# EAGLE design in_out (EAGLE 7.7.0)
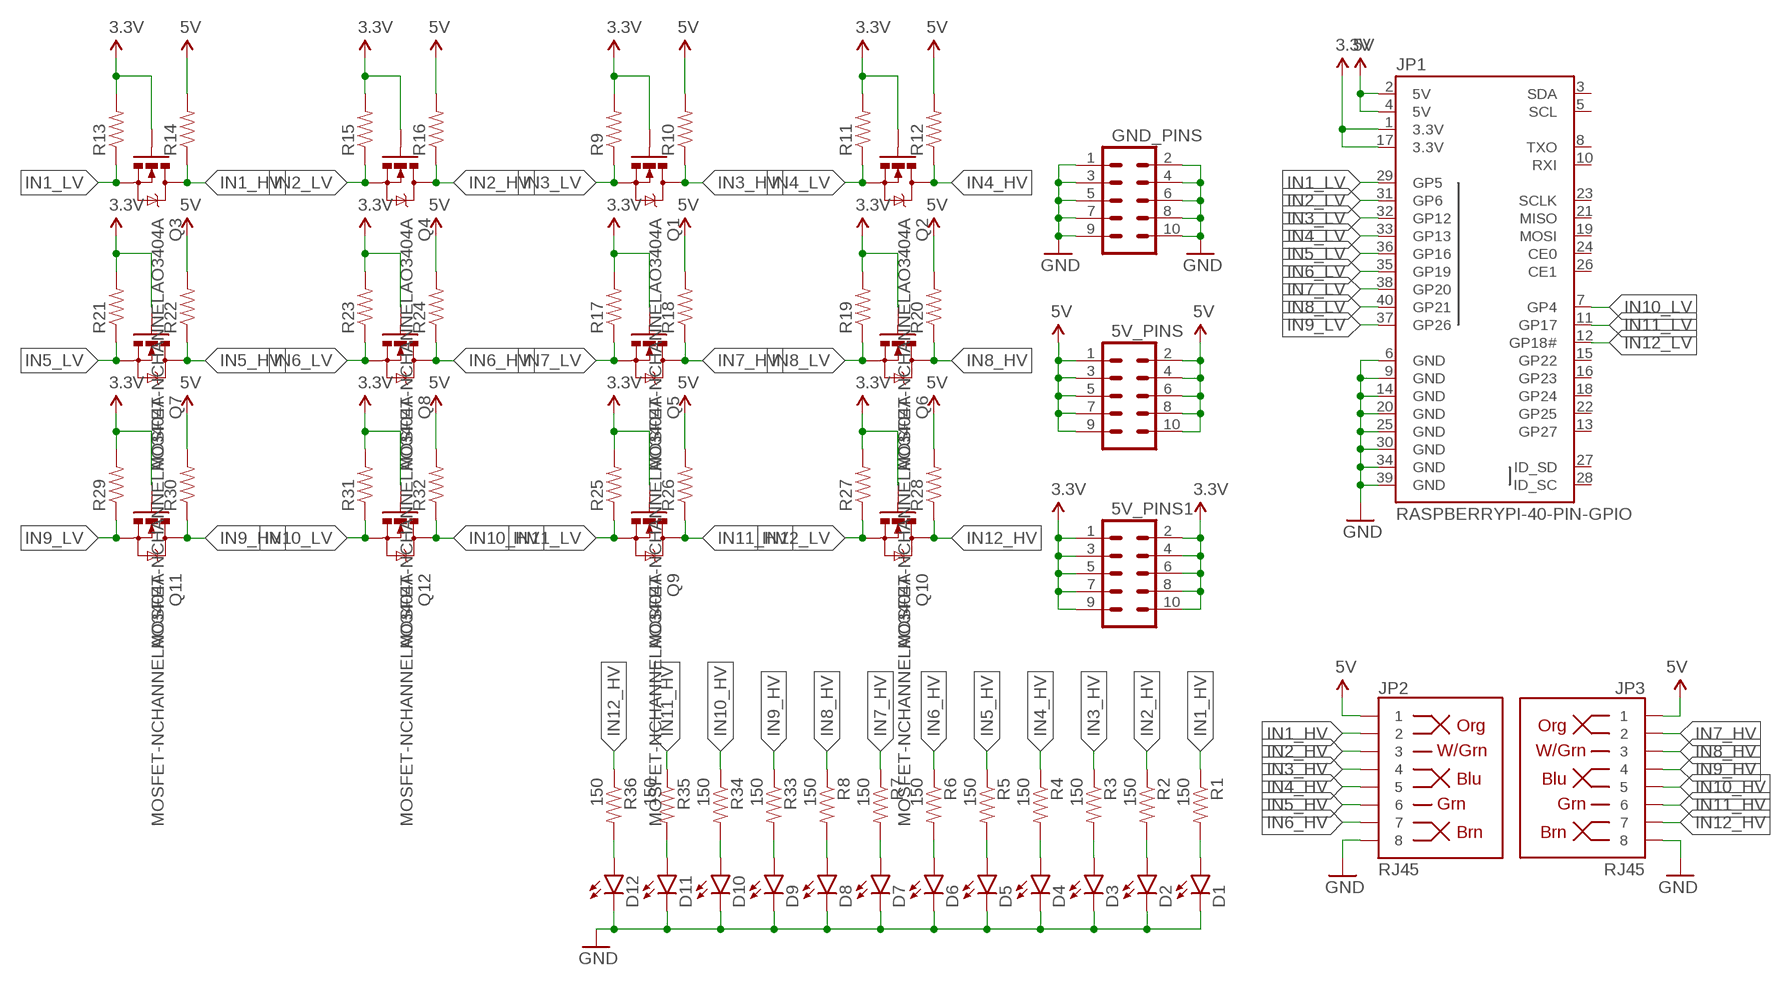
[diagram p0: schematic, sheet 1]

## Parts
5V_PINS  M05X2PTH  [AVR_ICSP]
5V_PINS1  M05X2PTH  [AVR_ICSP]
D1  LED5MM  [LED5MM]
D2  LED5MM  [LED5MM]
D3  LED5MM  [LED5MM]
D4  LED5MM  [LED5MM]
D5  LED5MM  [LED5MM]
D6  LED5MM  [LED5MM]
D7  LED5MM  [LED5MM]
D8  LED5MM  [LED5MM]
D9  LED5MM  [LED5MM]
D10  LED5MM  [LED5MM]
D11  LED5MM  [LED5MM]
D12  LED5MM  [LED5MM]
GND_PINS  M05X2PTH  [AVR_ICSP]
JP1  RASPBERRYPI-40-PIN-GPIO  [2X20-SHROUDED]
JP2  RJ45  RJ45-8PTH  [RJ45-8]
JP3  RJ45  RJ45-8PTH  [RJ45-8]
Q1  MOSFET-NCHANNELAO3404A  [SOT23-3]
Q2  MOSFET-NCHANNELAO3404A  [SOT23-3]
Q3  MOSFET-NCHANNELAO3404A  [SOT23-3]
Q4  MOSFET-NCHANNELAO3404A  [SOT23-3]
Q5  MOSFET-NCHANNELAO3404A  [SOT23-3]
Q6  MOSFET-NCHANNELAO3404A  [SOT23-3]
Q7  MOSFET-NCHANNELAO3404A  [SOT23-3]
Q8  MOSFET-NCHANNELAO3404A  [SOT23-3]
Q9  MOSFET-NCHANNELAO3404A  [SOT23-3]
Q10  MOSFET-NCHANNELAO3404A  [SOT23-3]
Q11  MOSFET-NCHANNELAO3404A  [SOT23-3]
Q12  MOSFET-NCHANNELAO3404A  [SOT23-3]
R1  150  RESISTOREZ  [AXIAL-0.3EZ]
R2  150  RESISTOREZ  [AXIAL-0.3EZ]
R3  150  RESISTOREZ  [AXIAL-0.3EZ]
R4  150  RESISTOREZ  [AXIAL-0.3EZ]
R5  150  RESISTOREZ  [AXIAL-0.3EZ]
R6  150  RESISTOREZ  [AXIAL-0.3EZ]
R7  150  RESISTOREZ  [AXIAL-0.3EZ]
R8  150  RESISTOREZ  [AXIAL-0.3EZ]
R9  RESISTORPTH-1/4W  [AXIAL-0.4]
R10  RESISTORPTH-1/4W  [AXIAL-0.4]
R11  RESISTORPTH-1/4W  [AXIAL-0.4]
R12  RESISTORPTH-1/4W  [AXIAL-0.4]
R13  RESISTORPTH-1/4W  [AXIAL-0.4]
R14  RESISTORPTH-1/4W  [AXIAL-0.4]
R15  RESISTORPTH-1/4W  [AXIAL-0.4]
R16  RESISTORPTH-1/4W  [AXIAL-0.4]
R17  RESISTORPTH-1/4W  [AXIAL-0.4]
R18  RESISTORPTH-1/4W  [AXIAL-0.4]
R19  RESISTORPTH-1/4W  [AXIAL-0.4]
R20  RESISTORPTH-1/4W  [AXIAL-0.4]
R21  RESISTORPTH-1/4W  [AXIAL-0.4]
R22  RESISTORPTH-1/4W  [AXIAL-0.4]
R23  RESISTORPTH-1/4W  [AXIAL-0.4]
R24  RESISTORPTH-1/4W  [AXIAL-0.4]
R25  RESISTORPTH-1/4W  [AXIAL-0.4]
R26  RESISTORPTH-1/4W  [AXIAL-0.4]
R27  RESISTORPTH-1/4W  [AXIAL-0.4]
R28  RESISTORPTH-1/4W  [AXIAL-0.4]
R29  RESISTORPTH-1/4W  [AXIAL-0.4]
R30  RESISTORPTH-1/4W  [AXIAL-0.4]
R31  RESISTORPTH-1/4W  [AXIAL-0.4]
R32  RESISTORPTH-1/4W  [AXIAL-0.4]
R33  150  RESISTOREZ  [AXIAL-0.3EZ]
R34  150  RESISTOREZ  [AXIAL-0.3EZ]
R35  150  RESISTOREZ  [AXIAL-0.3EZ]
R36  150  RESISTOREZ  [AXIAL-0.3EZ]

## Nets
3.3V: 5V_PINS1.1 5V_PINS1.2 5V_PINS1.3 5V_PINS1.4 5V_PINS1.5 5V_PINS1.6 5V_PINS1.7 5V_PINS1.8 5V_PINS1.9 5V_PINS1.10 JP1.1(3.3V) JP1.17(3.3V) Q1.1(G) Q2.1(G) Q3.1(G) Q4.1(G) Q5.1(G) Q6.1(G) Q7.1(G) Q8.1(G) Q9.1(G) Q10.1(G) Q11.1(G) Q12.1(G) R9.P$2 R11.P$2 R13.P$2 R15.P$2 R17.P$2 R19.P$2 R21.P$2 R23.P$2 R25.P$2 R27.P$2 R29.P$2 R31.P$2
5V: 5V_PINS.1 5V_PINS.2 5V_PINS.3 5V_PINS.4 5V_PINS.5 5V_PINS.6 5V_PINS.7 5V_PINS.8 5V_PINS.9 5V_PINS.10 JP1.2(5V) JP1.4(5V) JP2.1 JP3.1 R10.P$2 R12.P$2 R14.P$2 R16.P$2 R18.P$2 R20.P$2 R22.P$2 R24.P$2 R26.P$2 R28.P$2 R30.P$2 R32.P$2
GND: D1.K(C) D2.K(C) D3.K(C) D4.K(C) D5.K(C) D6.K(C) D7.K(C) D8.K(C) D9.K(C) D10.K(C) D11.K(C) D12.K(C) GND_PINS.1 GND_PINS.2 GND_PINS.3 GND_PINS.4 GND_PINS.5 GND_PINS.6 GND_PINS.7 GND_PINS.8 GND_PINS.9 GND_PINS.10 JP1.6(GND) JP1.9(GND) JP1.14(GND) JP1.20(GND) JP1.25(GND) JP1.30(GND) JP1.34(GND) JP1.39(GND) JP2.8 JP3.8
IN1_HV: JP2.2 Q3.3(D) R1.P$1 R14.P$1
IN1_LV: JP1.29(GP5) Q3.2(S) R13.P$1
IN2_HV: JP2.3 Q4.3(D) R2.P$1 R16.P$1
IN2_LV: JP1.31(GP6) Q4.2(S) R15.P$1
IN3_HV: JP2.4 Q1.3(D) R3.P$1 R10.P$1
IN3_LV: JP1.32(GP12) Q1.2(S) R9.P$1
IN4_HV: JP2.5 Q2.3(D) R4.P$1 R12.P$1
IN4_LV: JP1.33(GP13) Q2.2(S) R11.P$1
IN5_HV: JP2.6 Q7.3(D) R5.P$1 R22.P$1
IN5_LV: JP1.36(GP16) Q7.2(S) R21.P$1
IN6_HV: JP2.7 Q8.3(D) R6.P$1 R24.P$1
IN6_LV: JP1.35(GP19) Q8.2(S) R23.P$1
IN7_HV: JP3.2 Q5.3(D) R7.P$1 R18.P$1
IN7_LV: JP1.38(GP20) Q5.2(S) R17.P$1
IN8_HV: JP3.3 Q6.3(D) R8.P$1 R20.P$1
IN8_LV: JP1.40(GP21) Q6.2(S) R19.P$1
IN9_HV: JP3.4 Q11.3(D) R30.P$1 R33.P$1
IN9_LV: JP1.37(GP26) Q11.2(S) R29.P$1
IN10_HV: JP3.5 Q12.3(D) R32.P$1 R34.P$1
IN10_LV: JP1.7(GP4) Q12.2(S) R31.P$1
IN11_HV: JP3.6 Q9.3(D) R26.P$1 R35.P$1
IN11_LV: JP1.11(GP17) Q9.2(S) R25.P$1
IN12_HV: JP3.7 Q10.3(D) R28.P$1 R36.P$1
IN12_LV: JP1.12(GP18#) Q10.2(S) R27.P$1
N$1: D9.A R33.P$2
N$2: D10.A R34.P$2
N$3: D1.A R1.P$2
N$4: D2.A R2.P$2
N$5: D3.A R3.P$2
N$6: D4.A R4.P$2
N$7: D5.A R5.P$2
N$8: D6.A R6.P$2
N$9: D7.A R7.P$2
N$10: D8.A R8.P$2
N$11: D11.A R35.P$2
N$12: D12.A R36.P$2
Unconnected: JP1.3(SDA) JP1.5(SCL) JP1.8(TXO) JP1.10(RXI) JP1.13(GP27) JP1.15(GP22) JP1.16(GP23) JP1.18(GP24) JP1.19(MOSI) JP1.21(MISO) JP1.22(GP25) JP1.23(SCLK) JP1.24(CE0) JP1.26(CE1) JP1.27(ID_SD) JP1.28(ID_SC)

## Library data of the parts
5V_PINS 5V_PINS1 GND_PINS = SparkFun-Connectors:M05X2: Header 5x2 Standard 10-pin dual row 0.1" header. Commonly used with AVR-ISP. Use with Spark Fun Electronics SKU: PRT-00778
D1-D12 = SparkFun-LED:LED: LEDs Standard schematic elements and footprints for 5mm, 3mm, 1206, and 0603 sized LEDs. 5mm - Spark Fun Electronics SKU : COM-00529 (and others)
JP1 = SparkFun-Boards:RASPBERRYPI-40-PIN-GPIO: Second Generation Raspberry Pi GPIO Header 2x20 pin connector, as found on B, B+, A+ models.
JP2 JP3 = SparkFun-Connectors:RJ45-8: RJ45 Jack Simple RJ45, 8-pin connection - connector for common Cat5, Cat5e, and Cat6 Ethernet cables. Footprint not yet proven in production. Connector sku is PRT-00643; Breakout PCB sku is BOB-00716.; PROD_ID: CONN-08506
Q1-Q12 = SparkFun-DiscreteSemi:MOSFET-NCHANNEL: Common NMOSFET Parts MFG P/N Store ID Prod ID FDD8780 TRANS-09984 SI7820DN TRANS-11055 FDS6630A IC-08089 2N7002PW TRANS-11151 FQP30N06L COM-10213 TRANS-10060 BSS123LT1G TRANS-08345 BSS138 TRANS-00830 BS170 2N7000; PROD_ID: TRAN-12988
R1-R36 = SparkFun-Passives:RESISTOR: Resistor Basic schematic elements and footprints for 0603, 1206, and PTH resistors.

## Board
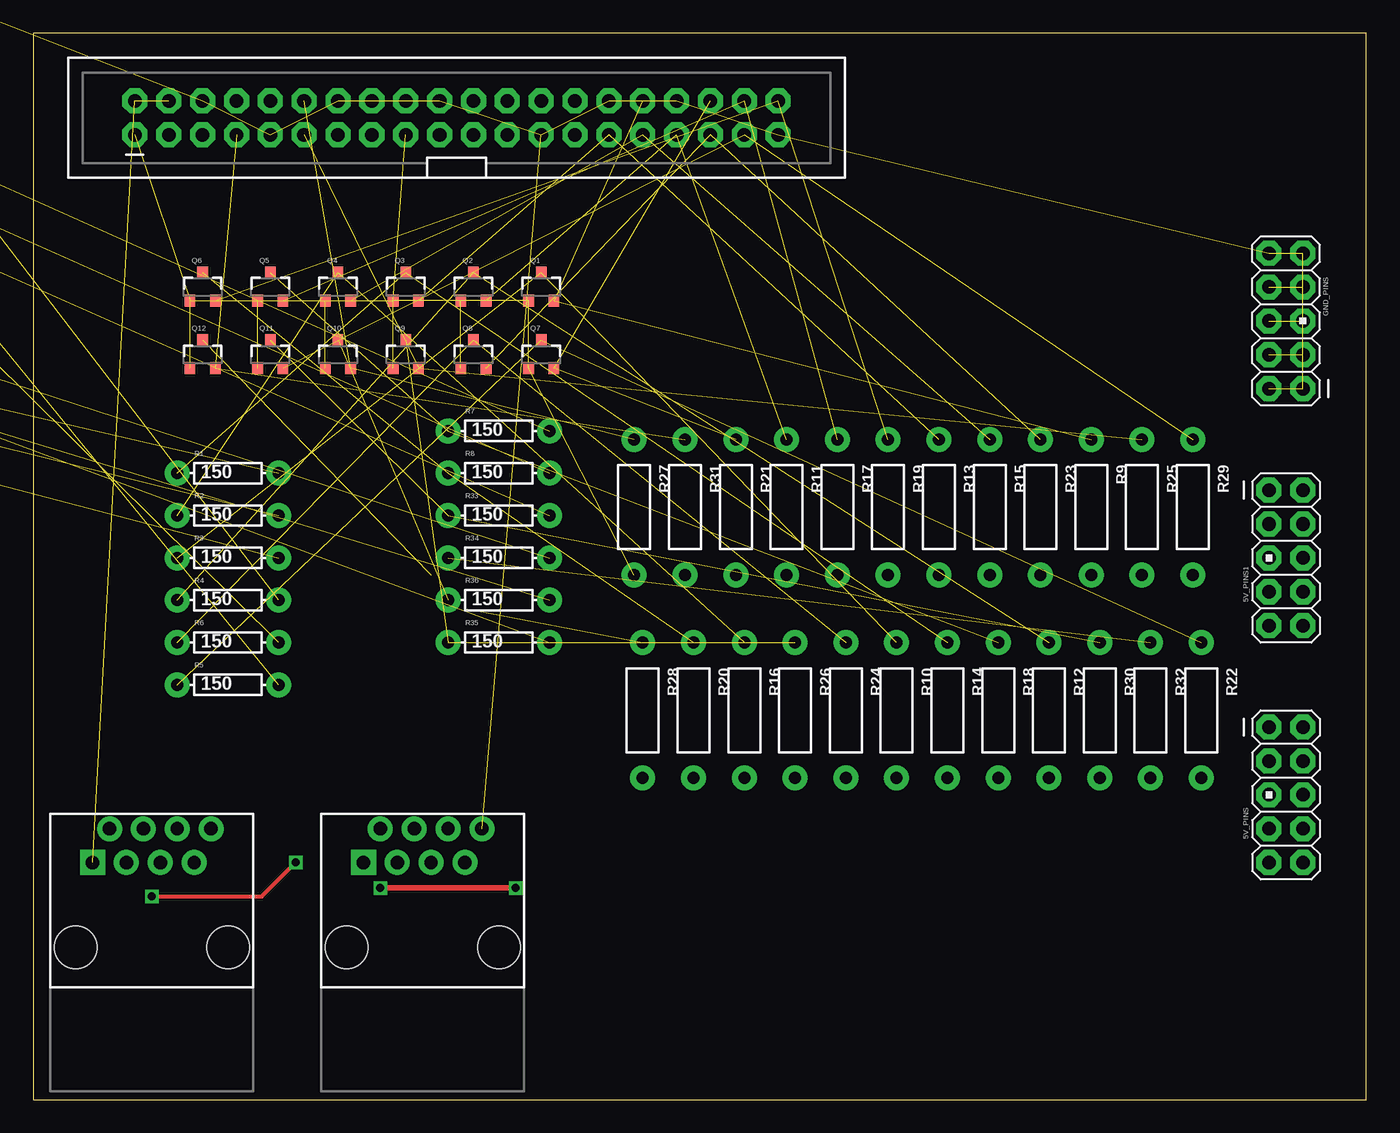
[diagram p1: board, top side]
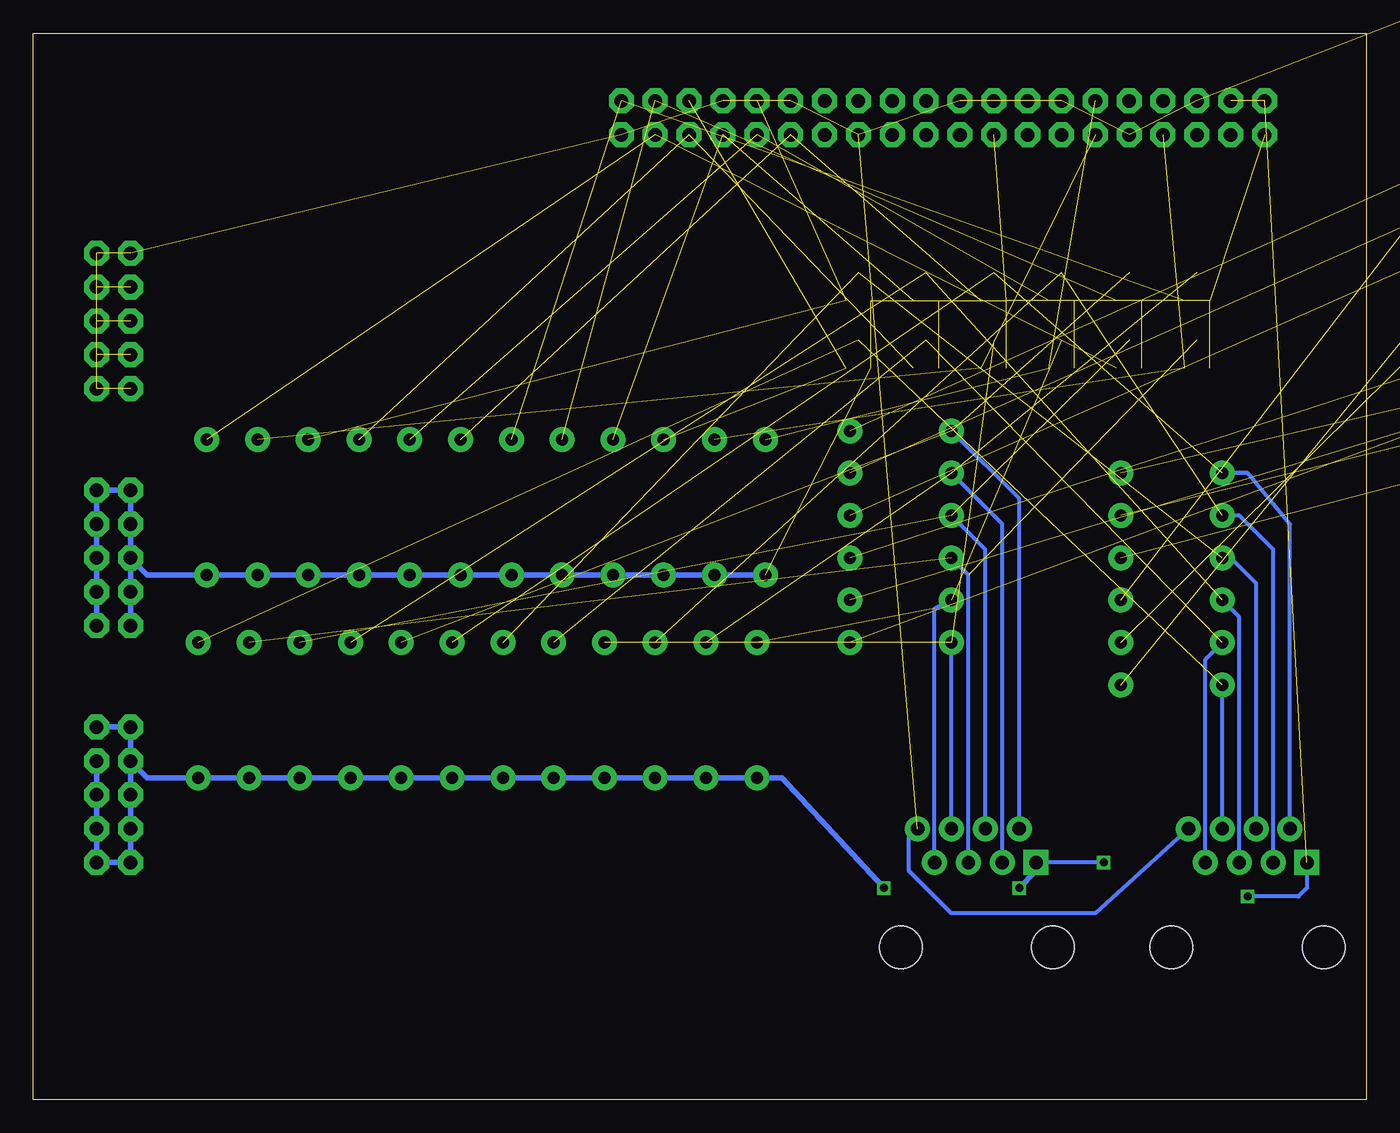
[diagram p2: board, bottom side, seen from below]

Size 100 x 80 mm. Coordinates in mm from the lower left corner, seen from the top.
Outline: 0,0 100,0 100,80 0,80 0,0
Copper layers (1*16): Top 0.035mm / dielectric 1.5mm / Bottom 0.035mm
Design rules "default": minimum track width 10mil, minimum drill 24mil, track to track 8mil, track to pad 8mil, pad to pad 8mil, via to via 8mil, smd to smd 8mil, copper to edge 40mil, drill to drill 8mil, minimum pad ring 10mil, minimum via ring 8mil, stop-mask expansion 4mil, vias tented up to drill 0mil, thermal gap 10mil

### Footprints (pad centres in the part's own frame; a part is rotated, then mirrored left to right if it is on the bottom)
AVR_ICSP = drill 1.016 pad 1.88 octagon: 1 -1.27,5.08; 2 1.27,5.08; 3 -1.27,2.54; 4 1.27,2.54; 5 -1.27,0; 6 1.27,0; 7 -1.27,-2.54; 8 1.27,-2.54; 9 -1.27,-5.08; 10 1.27,-5.08
LED5MM = drill 0.813 pad 1.88: A -1.27,0; K 1.27,0
2X20-SHROUDED = drill 1.016 pad 1.88 octagon: 1 -1.27,24.13; 2 1.27,24.13; 3 -1.27,21.59; 4 1.27,21.59; 5 -1.27,19.05; 6 1.27,19.05; 7 -1.27,16.51; 8 1.27,16.51; 9 -1.27,13.97; 10 1.27,13.97; 11 -1.27,11.43; 12 1.27,11.43; 13 -1.27,8.89; 14 1.27,8.89; 15 -1.27,6.35; 16 1.27,6.35; 17 -1.27,3.81; 18 1.27,3.81; 19 -1.27,1.27; 20 1.27,1.27; 21 -1.27,-1.27; 22 1.27,-1.27; 23 -1.27,-3.81; 24 1.27,-3.81; 25 -1.27,-6.35; 26 1.27,-6.35; 27 -1.27,-8.89; 28 1.27,-8.89; 29 -1.27,-11.43; 30 1.27,-11.43; 31 -1.27,-13.97; 32 1.27,-13.97; 33 -1.27,-16.51; 34 1.27,-16.51; 35 -1.27,-19.05; 36 1.27,-19.05; 37 -1.27,-21.59; 38 1.27,-21.59; 39 -1.27,-24.13; 40 1.27,-24.13
RJ45-8 = drill 1 pad 1.88 square: 1 -4.445,6.35 | drill 1 pad 1.88: 2 -3.175,8.89; 3 -1.905,6.35; 4 -0.635,8.89; 5 0.635,6.35; 6 1.905,8.89; 7 3.175,6.35; 8 4.445,8.89 | hole 3.2: -5.715,0; 5.715,0
SOT23-3 = smd 0.8 x 0.9: 1 -0.95,-1; 2 0.95,-1; 3 0,1.1
AXIAL-0.3EZ = drill 0.9 pad 1.88: P$1 -3.81,0; P$2 3.81,0
AXIAL-0.4 = drill 0.9 pad 1.88: P$1 -5.08,0; P$2 5.08,0

### Placement (x,y rotation side)
5V_PINS  93.98,22.86 0 top
5V_PINS1  93.98,40.64 0 top
D1  -57.15,64.77 0 top  (outside the outline)
D2  -64.77,64.77 0 top  (outside the outline)
D3  -72.39,64.77 0 top  (outside the outline)
D4  -17.78,86.36 0 top  (outside the outline)
D5  -25.4,86.36 0 top  (outside the outline)
D6  -33.02,86.36 0 top  (outside the outline)
D7  -40.64,86.36 0 top  (outside the outline)
D8  -48.26,86.36 0 top  (outside the outline)
D9  -55.88,86.36 0 top  (outside the outline)
D10  -34.29,64.77 0 top  (outside the outline)
D11  -41.91,64.77 0 top  (outside the outline)
D12  -49.53,64.77 0 top  (outside the outline)
GND_PINS  93.98,58.42 180 top
JP1  31.75,73.66 90 top
JP2  8.89,11.43 0 top
JP3  29.21,11.43 0 top
Q1  38.1,60.96 0 top
Q2  33.02,60.96 0 top
Q3  27.94,60.96 0 top
Q4  22.86,60.96 0 top
Q5  17.78,60.96 0 top
Q6  12.7,60.96 0 top
Q7  38.1,55.88 0 top
Q8  33.02,55.88 0 top
Q9  27.94,55.88 0 top
Q10  22.86,55.88 0 top
Q11  17.78,55.88 0 top
Q12  12.7,55.88 0 top
R1  14.61,46.99 0 top
R2  14.61,43.81 0 top
R3  14.61,40.64 0 top
R4  14.61,37.47 0 top
R5  14.61,31.11 0 top
R6  14.61,34.29 0 top
R7  34.92,50.16 0 top
R8  34.92,46.99 0 top
R9  79.38,44.45 270 top
R10  64.77,29.21 270 top
R11  56.52,44.45 270 top
R12  76.2,29.21 270 top
R13  67.94,44.45 270 top
R14  68.58,29.21 270 top
R15  71.75,44.45 270 top
R16  53.34,29.21 270 top
R17  60.33,44.45 270 top
R18  72.39,29.21 270 top
R19  64.14,44.45 270 top
R20  49.53,29.21 270 top
R21  52.7,44.45 270 top
R22  87.63,29.21 270 top
R23  75.56,44.45 270 top
R24  60.96,29.21 270 top
R25  83.19,44.45 270 top
R26  57.15,29.21 270 top
R27  45.09,44.45 270 top
R28  45.72,29.21 270 top
R29  87,44.45 270 top
R30  80.01,29.21 270 top
R31  48.9,44.45 270 top
R32  83.82,29.21 270 top
R33  34.92,43.81 0 top
R34  34.92,40.64 0 top
R35  34.92,34.29 0 top
R36  34.92,37.47 0 top

### Tracks (layer width: path | path; a pad name or v marks a point on that pad's centre or on a via)
3.3V  (14 unrouted)
  Bottom 0.406: 5V_PINS1.5 5V_PINS1.7 5V_PINS1.9 | 5V_PINS1.10 5V_PINS1.8 5V_PINS1.6 5V_PINS1.4 5V_PINS1.2 5V_PINS1.1 5V_PINS1.3 5V_PINS1.5 | 5V_PINS1.5 91.44,39.37 R29.P$2 R25.P$2 R9.P$2 R23.P$2 R15.P$2 R13.P$2 R19.P$2 R17.P$2 R11.P$2 R21.P$2 R31.P$2 R27.P$2
5V  (via drill 0.6)  (2 unrouted)
  Top 0.3: v8.89,15.24 17.14,15.24 v19.68,17.78
  Top 0.406: v36.2,15.88 v26.04,15.88
  Bottom 0.3: JP2.1 4.45,15.88 5.08,15.24 v8.89,15.24 | v19.68,17.78 JP3.1
  Bottom 0.406: v36.2,15.88 43.81,24.13 R28.P$2 R20.P$2 R16.P$2 R26.P$2 R24.P$2 R10.P$2 R14.P$2 R18.P$2 R12.P$2 R30.P$2 R32.P$2 R22.P$2 91.44,24.13 5V_PINS.3 | v26.04,15.88 24.77,17.14 JP3.1 | 5V_PINS.2 5V_PINS.1 5V_PINS.3 | 5V_PINS.3 5V_PINS.5 5V_PINS.7 5V_PINS.9 5V_PINS.10 5V_PINS.8 5V_PINS.6 5V_PINS.4
GND  (30 unrouted)
  Bottom 0.3: JP2.8 20.32,13.97 31.11,13.97 34.29,17.14 34.29,19.68 JP3.8
IN1_HV  (2 unrouted)
  Bottom 0.3: JP2.2 5.71,43.18 8.89,46.99 R1.P$1
IN1_LV  (2 unrouted)
IN2_HV  (2 unrouted)
  Bottom 0.3: JP2.3 6.99,41.27 9.53,43.81 R2.P$1
IN2_LV  (2 unrouted)
IN3_HV  (2 unrouted)
  Bottom 0.3: JP2.4 8.26,38.73 10.16,40.64 R3.P$1
IN3_LV  (2 unrouted)
IN4_HV  (2 unrouted)
  Bottom 0.3: JP2.5 9.53,36.2 R4.P$1
IN4_LV  (2 unrouted)
IN5_HV  (2 unrouted)
  Bottom 0.3: JP2.6 R5.P$1
IN5_LV  (2 unrouted)
IN6_HV  (2 unrouted)
  Bottom 0.3: JP2.7 12.06,33.02 R6.P$1
IN6_LV  (2 unrouted)
IN7_HV  (2 unrouted)
  Bottom 0.3: JP3.2 26.04,45.09 R7.P$1
IN7_LV  (2 unrouted)
IN8_HV  (2 unrouted)
  Bottom 0.3: JP3.3 27.3,43.18 R8.P$1
IN8_LV  (2 unrouted)
IN9_HV  (2 unrouted)
  Bottom 0.3: JP3.4 28.57,41.27 R33.P$1
IN9_LV  (2 unrouted)
IN10_HV  (2 unrouted)
  Bottom 0.3: JP3.5 29.84,39.37 R34.P$1
IN10_LV  (2 unrouted)
IN11_HV  (2 unrouted)
  Bottom 0.3: JP3.6 R35.P$1
IN11_LV  (2 unrouted)
IN12_HV  (2 unrouted)
  Bottom 0.3: JP3.7 32.38,36.83 R36.P$1
IN12_LV  (2 unrouted)
N$1  (1 unrouted)
N$2  (1 unrouted)
N$3  (1 unrouted)
N$4  (1 unrouted)
N$5  (1 unrouted)
N$6  (1 unrouted)
N$7  (1 unrouted)
N$8  (1 unrouted)
N$9  (1 unrouted)
N$10  (1 unrouted)
N$11  (1 unrouted)
N$12  (1 unrouted)